# EAGLE design PCF8574T (EAGLE 6.4)
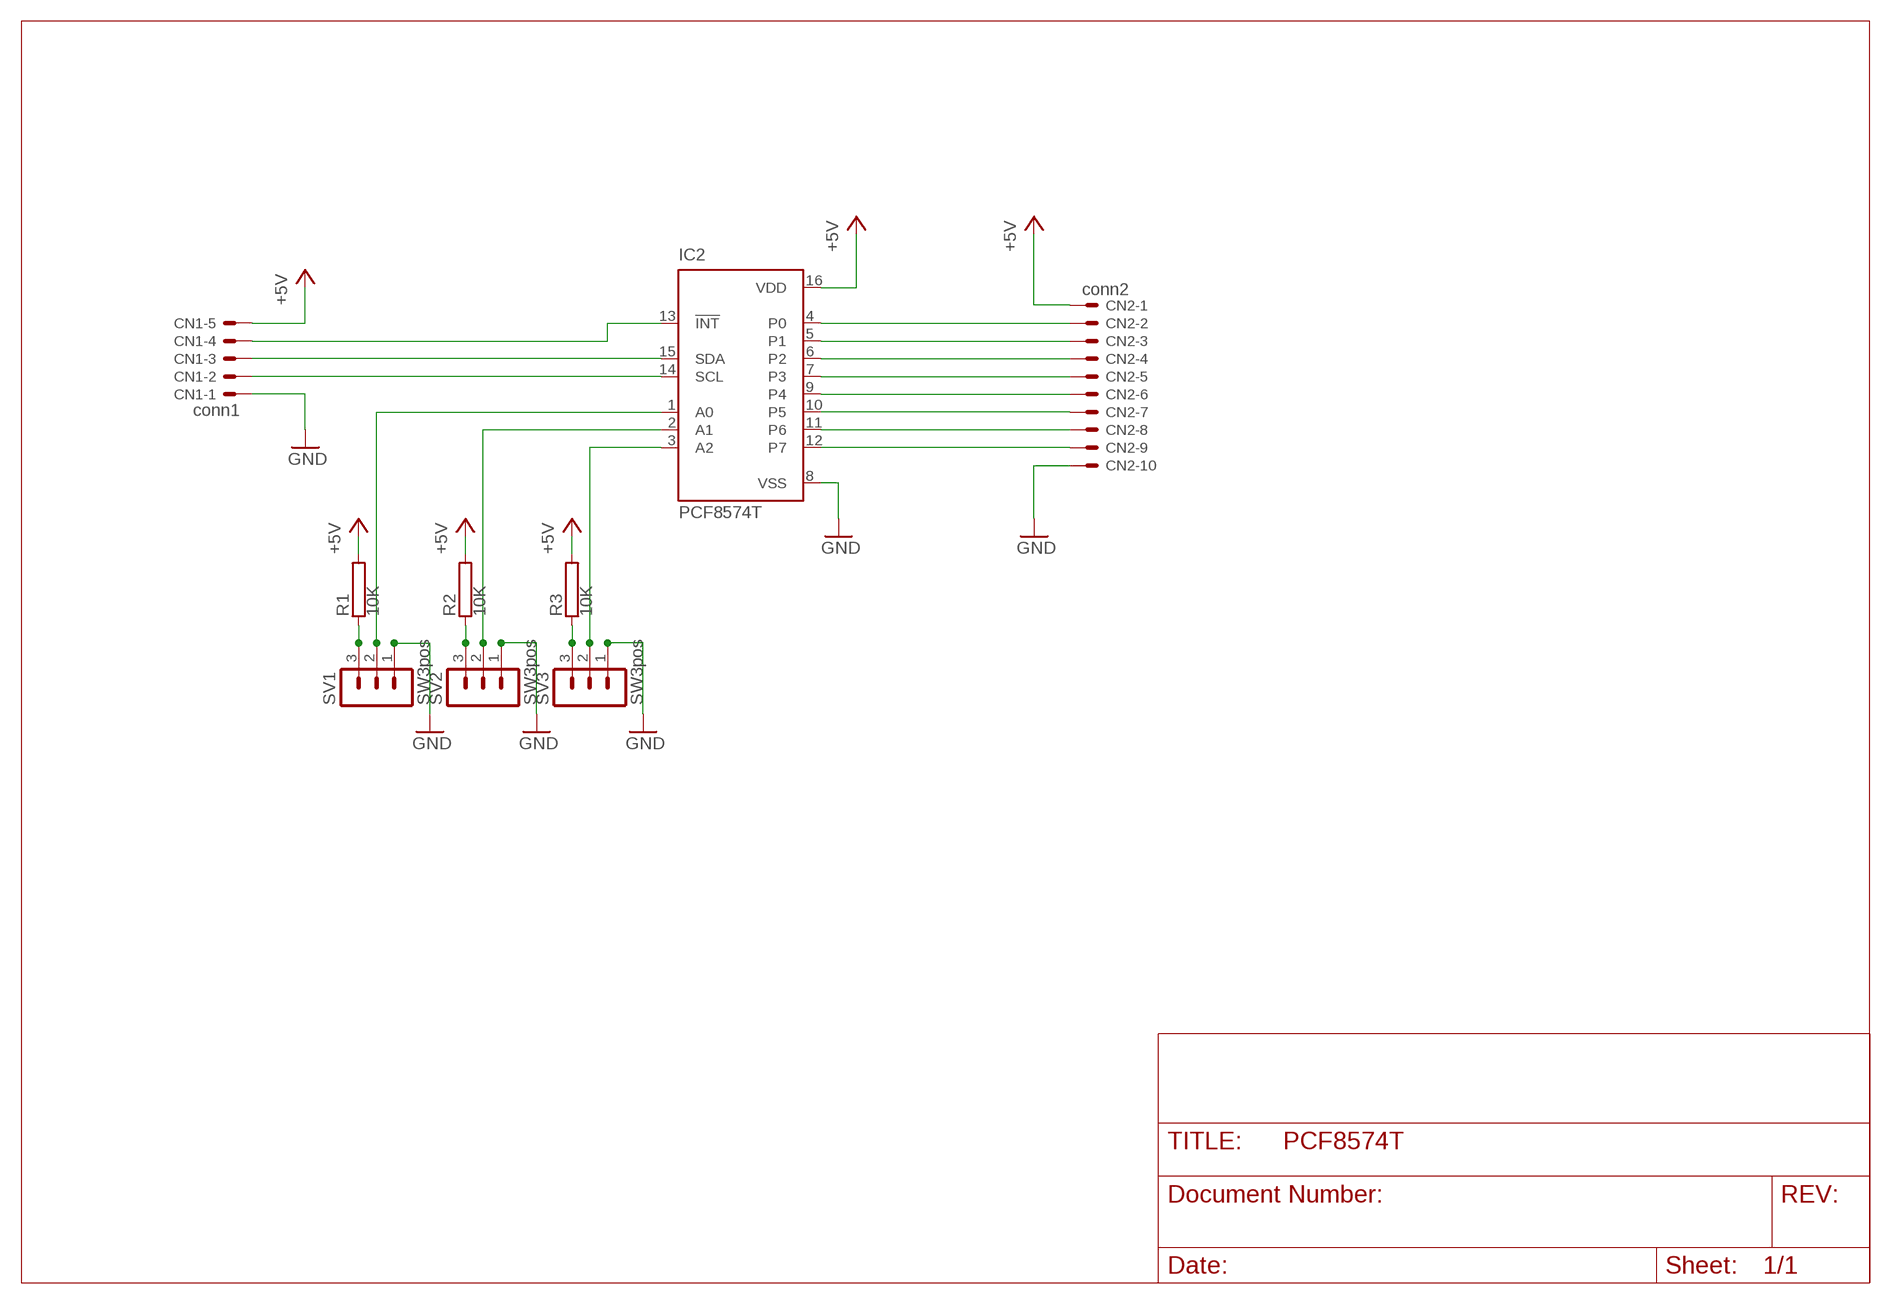
[diagram p0: schematic, sheet 1]

## Parts
CN1  conn1  22-23-2051  [22-23-2051]
CN2  conn2  22-23-2101  [22-23-2101]
IC2  PCF8574T  [SO16W]
R1  10K  RHPS58  [HPS58]
R2  10K  RHPS58  [HPS58]
R3  10K  RHPS58  [HPS58]
SV1  SW3pos  MA03-1  [MA03-1]
SV2  SW3pos  MA03-1  [MA03-1]
SV3  SW3pos  MA03-1  [MA03-1]

## Nets
+5V: CN1.5 CN2.1 IC2.16(VDD) R1.2 R2.2 R3.2
N$1: R1.1 SV1.3
N$2: R2.1 SV2.3
N$3: R3.1 SV3.3
N$4: IC2.1(A0) SV1.2
N$5: IC2.2(A1) SV2.2
N$6: IC2.3(A2) SV3.2
N$7: CN1.4 IC2.13(!INT)
N$8: CN1.1 CN2.10 IC2.8(VSS) SV1.1 SV2.1 SV3.1 ; supply symbol labelled GND
N$12: CN2.2 IC2.4(P0)
N$13: CN2.3 IC2.5(P1)
N$14: CN2.4 IC2.6(P2)
N$15: CN2.5 IC2.7(P3)
N$16: CN2.6 IC2.9(P4)
N$17: CN2.7 IC2.10(P5)
N$18: CN2.8 IC2.11(P6)
N$19: CN2.9 IC2.12(P7)
N$20: CN1.2 IC2.14(SCL)
N$21: CN1.3 IC2.15(SDA)

## Library data of the parts
CN1 = con-molex:22-23-2051: .100" (2.54mm) Center Header - 5 Pin; MF: MOLEX; MPN: 22-23-2051; OC_FARNELL: 1462952; OC_NEWARK: 38C9178
CN2 = con-molex:22-23-2101: .100" (2.54mm) Center Header - 10 Pin; MF: MOLEX; MPN: 22-23-2101; OC_FARNELL: 1756828; OC_NEWARK: 94C0765
IC2 = micro-philips:PCF8574: I2C-Bus Remote 8-bit I/O expander http://www.semiconductors.philips.com/acrobat_download/datasheets/PCF8574_4.pdf; MPN: PCF8574T/3,512; OC_FARNELL: 1201255; OC_NEWARK: 70R6870
R1-R3 = resistor-power:R: Power Resitor; OC_FARNELL: unknown; OC_NEWARK: unknown
SV1-SV3 = con-lstb:MA03-1: PIN HEADER; OC_FARNELL: unknown; OC_NEWARK: unknown

## Board
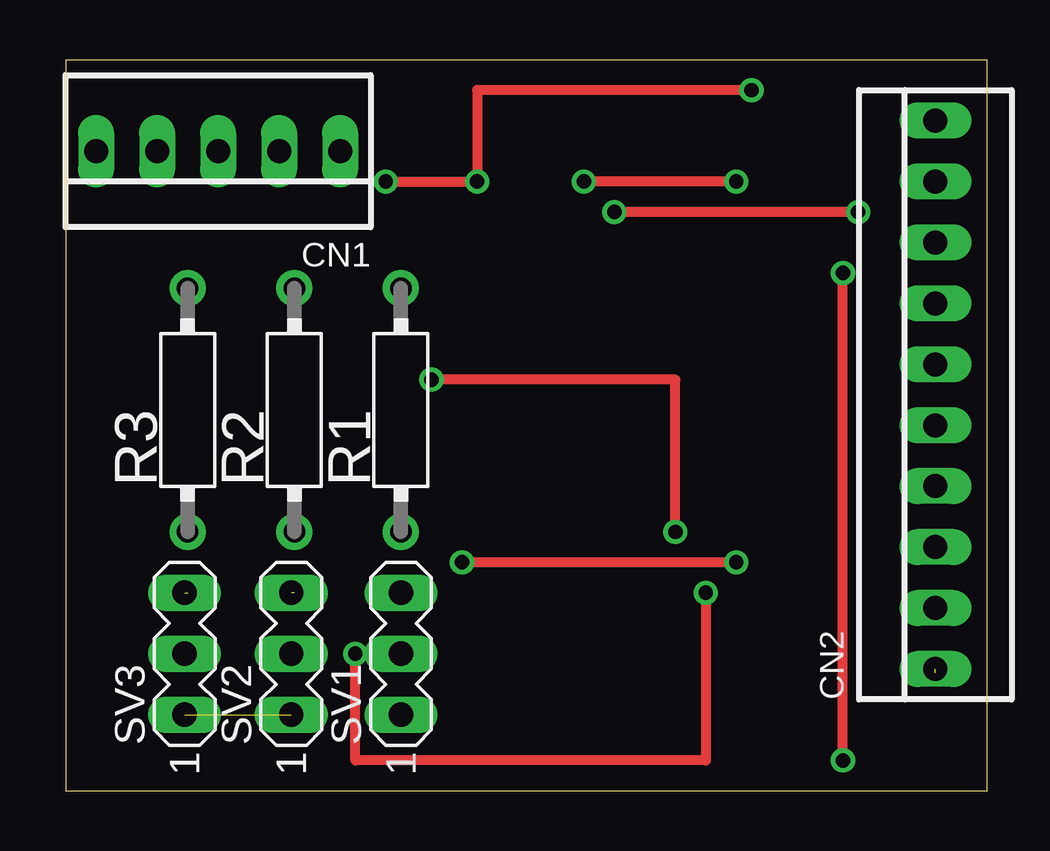
[diagram p1: board, top side]
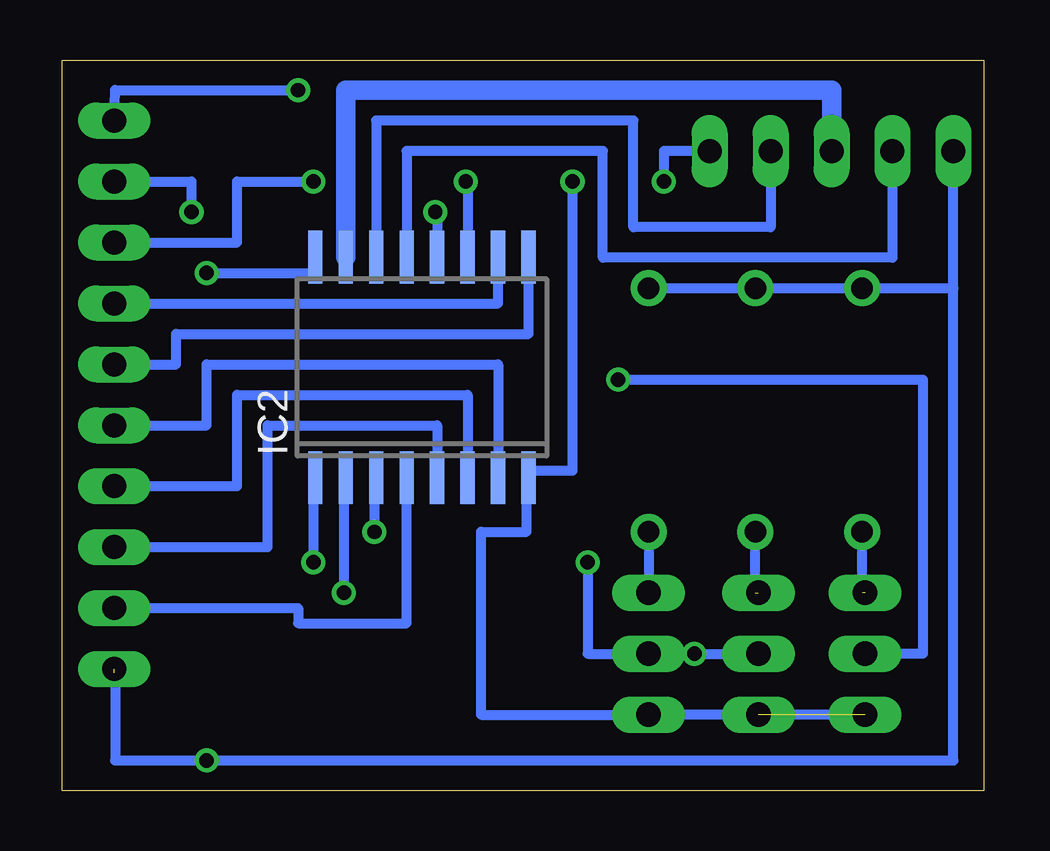
[diagram p2: board, bottom side, seen from below]

Size 38.41 x 30.47 mm. Coordinates in mm from the lower left corner, seen from the top.
Outline: 0,0 38.41,0 38.41,30.47 0,30.47 0,0
Copper layers (1*16): Top 0.035mm / dielectric 1.5mm / Bottom 0.035mm
Design rules "default": minimum track width 10mil, minimum drill 24mil, track to track 8mil, track to pad 8mil, pad to pad 8mil, via to via 8mil, smd to smd 8mil, copper to edge 40mil, drill to drill 8mil, minimum pad ring 10mil, minimum via ring 8mil, stop-mask expansion 4mil, vias tented up to drill 0mil, thermal gap 10mil

### Footprints (pad centres in the part's own frame; a part is rotated, then mirrored left to right if it is on the bottom)
22-23-2051 = drill 1 long: 1 -5.08,0; 2 -2.54,0; 3 0,0; 4 2.54,0; 5 5.08,0
22-23-2101 = drill 1 long: 1 -11.43,0; 2 -8.89,0; 3 -6.35,0; 4 -3.81,0; 5 -1.27,0; 6 1.27,0; 7 3.81,0; 8 6.35,0; 9 8.89,0; 10 11.43,0
SO16W = smd 0.6 x 2.2: 1 -4.445,-4.6; 2 -3.175,-4.6; 3 -1.905,-4.6; 4 -0.635,-4.6; 5 0.635,-4.6; 6 1.905,-4.6; 7 3.175,-4.6; 8 4.445,-4.6; 9 4.445,4.6; 10 3.175,4.6; 11 1.905,4.6; 12 0.635,4.6; 13 -0.635,4.6; 14 -1.905,4.6; 15 -3.175,4.6; 16 -4.445,4.6
HPS58 = drill 0.9 pad 1.5: 1 -5.08,0; 2 5.08,0
MA03-1 = drill 1.016 long: 1 -2.54,0; 2 0,0; 3 2.54,0

### Placement (x,y rotation side)
CN1  6.35,26.67 180 top
CN2  36.23,16.51 90 top
IC2  23.42,17.65 0 bottom
R1  13.97,15.88 90 top
R2  9.53,15.88 90 top
R3  5.08,15.88 90 top
SV1  13.97,5.71 90 top
SV2  9.4,5.71 90 top
SV3  4.95,5.71 90 top

### Tracks (layer width: path | path; a pad name or v marks a point on that pad's centre or on a via)
+5V  (via drill 0.6)  (1 unrouted)
  Top 0.406: v32.39,1.27 v32.39,21.59
  Bottom 0.254: R1.2 R2.2
  Bottom 0.406: R1.2 R3.2 1.27,20.96 | 1.27,20.96 CN1.5 | v32.39,21.59 27.86,21.59 IC2.16 | 36.23,4.91 36.2,4.91 36.2,1.27 v32.39,1.27 1.27,1.27 1.27,20.96
N$1
  Bottom 0.406: R1.1 SV1.3
N$2  (1 unrouted)
  Bottom 0.406: 9.53,8.25 R2.1
N$3  (1 unrouted)
  Bottom 0.406: 5.08,8.25 R3.1
N$4  (via drill 0.6 pad 0.41)
  Top 0.406: v27.94,9.52 v16.51,9.52
  Bottom 0.406: IC2.1 27.94,13.05 v27.94,9.52 | v16.51,9.52 16.51,5.71 SV1.2
N$5  (via drill 0.6 pad 0.41)
  Top 0.406: v26.67,8.25 26.67,1.27 12.07,1.27 v12.07,5.71
  Bottom 0.406: IC2.2 26.67,13.05 v26.67,8.25 | v12.07,5.71 SV2.2
N$6  (via drill 0.6 pad 0.41)
  Top 0.406: v25.4,10.79 25.4,17.14 v15.24,17.14
  Bottom 0.406: IC2.3 25.4,13.05 v25.4,10.79 | v15.24,17.14 2.54,17.14 2.54,5.71 SV3.2
N$7
  Bottom 0.406: CN1.4 3.81,22.22 15.88,22.22 15.88,26.67 24.05,26.67 IC2.13
N$8  (via drill 0.6 pad 0.41)  (2 unrouted)
  Top 0.406: v28.57,29.21 17.14,29.21 v17.14,25.4 v13.34,25.4
  Bottom 0.406: CN2.10 36.2,29.21 v28.57,29.21 | v17.14,25.4 17.14,13.33 18.97,13.33 IC2.8 19.05,13.05 19.05,10.79 20.96,10.79 20.96,3.18 SV1.1 5.71,3.18 | CN1.1 13.34,26.67 v13.34,25.4
N$12
  Bottom 0.406: CN2.2 28.57,7.62 28.57,6.98 24.05,6.98 IC2.4
N$13
  Bottom 0.406: CN2.3 29.85,10.16 29.85,15.24 22.78,15.24 IC2.5
N$14
  Bottom 0.406: CN2.4 31.11,12.7 31.11,16.51 21.51,16.51 IC2.6
N$15
  Bottom 0.406: CN2.5 32.39,15.24 32.39,17.78 20.24,17.78 IC2.7
N$16
  Bottom 0.406: CN2.6 33.66,17.78 33.66,19.05 18.97,19.05 IC2.9
N$17
  Bottom 0.406: CN2.7 20.24,20.32 IC2.10
N$18  (via drill 0.6 pad 0.41)
  Top 0.406: v27.94,25.4 v21.59,25.4
  Bottom 0.406: CN2.8 31.11,22.86 31.11,25.4 v27.94,25.4 | v21.59,25.4 21.51,25.4 IC2.11
N$19  (via drill 0.6 pad 0.41)
  Top 0.406: v33.02,24.13 v22.86,24.13
  Bottom 0.406: CN2.9 33.02,25.4 v33.02,24.13 | v22.86,24.13 22.78,24.13 IC2.12
N$20
  Bottom 0.406: CN1.2 8.89,23.5 14.61,23.5 14.61,27.94 25.32,27.94 IC2.14
N$21
  Bottom 0.813: CN1.3 6.35,29.21 26.59,29.21 IC2.15